# EAGLE design pcb_control_esp (EAGLE 7.4.0)
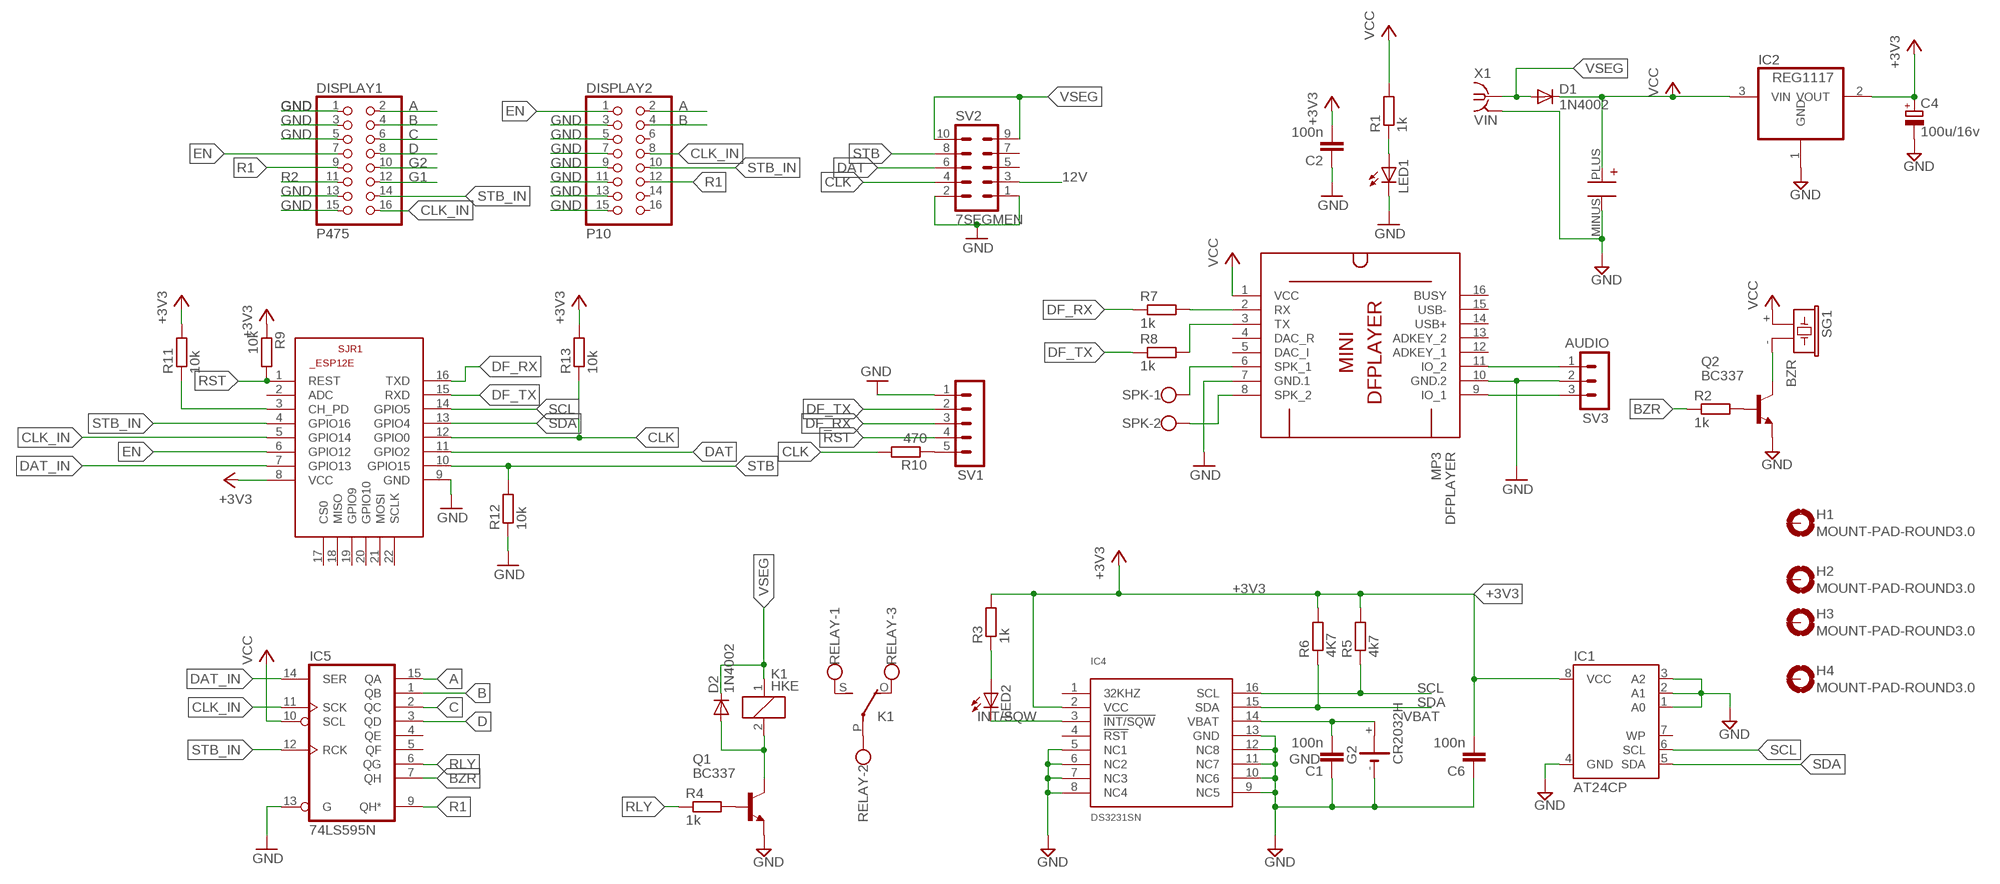
[diagram p0: schematic, sheet 1]

## Parts
C1  100n  C-EU025-024X044  [C025-024X044]
C2  100n  C-EU025-024X044  [C025-024X044]
C4  100u/16v  CPOL-EUE2.5-5  [E2,5-5]
C6  100n  C-EU025-024X044  [C025-024X044]
C24  1000U  EEU-FR1C471B  [EEU-FR1C471B]
D1  1N4002  1N4148DO35-10  [DO35-10]
D2  1N4002  1N4148DO35-10  [DO35-10]
DFPLAYER  MP3  DFPLAYER-MINI-MODULE  [DFPLAYER-MINI-MODULE]
DISPLAY1  P475  PINHD-2X8  [2X08]
DISPLAY2  P10  PINHD-2X8  [2X08]
G2  CR2032H  [CR2032H]
H1  MOUNT-PAD-ROUND3.0  [3,0-PAD]
H2  MOUNT-PAD-ROUND3.0  [3,0-PAD]
H3  MOUNT-PAD-ROUND3.0  [3,0-PAD]
H4  MOUNT-PAD-ROUND3.0  [3,0-PAD]
IC1  AT24CP  [DIL08]
IC2  REG1117  [SOT223]
IC4  DS3231SN  [SO16W]
IC5  74LS595N  [DIL16]
K1  HKE  ZF112  [ZF112]
LED1  LED3MM  [LED3MM]
LED2  LED3MM  [LED3MM]
Q1  BC337  BC548  [TO92-EBC]
Q2  BC337  BC548  [TO92-EBC]
R1  1k  R-EU_0207/7  [0207/7]
R2  1k  R-EU_0207/7  [0207/7]
R3  1k  R-EU_0207/7  [0207/7]
R4  1k  R-EU_0207/7  [0207/7]
R5  4k7  R-EU_0207/7  [0207/7]
R6  4K7  R-EU_0207/7  [0207/7]
R7  1k  R-EU_0207/7  [0207/7]
R8  1k  R-EU_0207/7  [0207/7]
R9  10k  R-EU_0207/7  [0207/7]
R10  470  R-EU_0207/7  [0207/7]
R11  10k  R-EU_0207/7  [0207/7]
R12  10k  R-EU_0207/7  [0207/7]
R13  10k  R-EU_0207/7  [0207/7]
RELAY  W237-103  [W237-103]
SG1  BZR  F/CM12P  [F/CM12P]
SJR1  ESP8266-12EESP12E  [ESP8266-ESP12E]
SPK  W237-102  [W237-102]
SV1  MA05-1  [MA05-1]
SV2  7SEGMEN  MA05-2  [MA05-2]
SV3  AUDIO  MA03-1  [MA03-1]
X1  VIN  SMA-J502-ND  [J502-ND]

## Nets
12V: SV2.3
+3V3: C2.2 C4.+ C6.2 IC1.8(VCC) IC2.2(VOUT) IC4.2(VCC) R3.2 R5.2 R6.2 R9.1 R11.2 R13.2 SJR1.8(VCC)
A: DISPLAY1.2 DISPLAY2.2 IC5.15(QA)
B: DISPLAY1.4 DISPLAY2.4 IC5.1(QB)
BZR: IC5.7(QH) R2.1
C: DISPLAY1.6 IC5.2(QC)
CLK: R10.2 R13.1 SJR1.12(GPIO0) SV2.4
CLK_IN: DISPLAY1.16 DISPLAY2.8 IC5.11(SCK) SJR1.5(GPIO14)
D: DISPLAY1.8 IC5.3(QD)
DAT: SJR1.11(GPIO2) SV2.6
DAT_IN: IC5.14(SER) SJR1.7(GPIO13)
DF_RX: R7.1 SJR1.16(TXD) SV1.3
DF_TX: R8.1 SJR1.15(RXD) SV1.2
EN: DISPLAY1.7 DISPLAY2.1 SJR1.6(GPIO12)
G1: DISPLAY1.12
G2: DISPLAY1.10
GND: C1.1 C2.1 C4.- C6.1 C24.MINUS DFPLAYER.7(GND.1) DFPLAYER.10(GND.2) DISPLAY1.1 DISPLAY1.3 DISPLAY1.5 DISPLAY1.13 DISPLAY1.15 DISPLAY2.3 DISPLAY2.5 DISPLAY2.7 DISPLAY2.9 DISPLAY2.11 DISPLAY2.13 DISPLAY2.15 G2.- IC1.1(A0) IC1.2(A1) IC1.3(A2) IC1.4(GND) IC2.1(GND) IC4.5(NC1) IC4.6(NC2) IC4.7(NC3) IC4.8(NC4) IC4.9(NC5) IC4.10(NC6) IC4.11(NC7) IC4.12(NC8) IC4.13(GND) IC5.13(G) LED1.K(C) Q1.E Q2.E R12.1 SJR1.9(GND) SV1.1 SV2.1 SV2.2 SV3.2 X1.2 X1.5
INT/SQW: IC4.3(!INT/SQW) LED2.K(C)
N$1: Q2.B R2.2
N$2: Q2.C SG1.-
N$3: LED2.A R3.1
N$4: K1.O(2:O) RELAY.3
N$5: R11.1 SJR1.3(CH_PD)
N$6: Q1.B R4.2
N$7: LED1.A R1.1
N$8: DFPLAYER.2(RX) R7.2
N$9: DFPLAYER.3(TX) R8.2
N$10: D2.A K1.2 Q1.C
N$11: R10.1 SV1.5
N$12: K1.S(2:S) RELAY.1
N$13: K1.P(2:P) RELAY.2
N$21: DFPLAYER.6(SPK_1) SPK.1
N$22: DFPLAYER.8(SPK_2) SPK.2
N$23: DFPLAYER.9(IO_1) SV3.3
N$24: DFPLAYER.11(IO_2) SV3.1
R1: DISPLAY1.9 DISPLAY2.12 IC5.9(QH*)
R2: DISPLAY1.11
RLY: IC5.6(QG) R4.1
RST: R9.2 SJR1.1(REST) SV1.4
SCL: IC1.6(SCL) IC4.16(SCL) R5.1 SJR1.14(GPIO5)
SDA: IC1.5(SDA) IC4.15(SDA) R6.1 SJR1.13(GPIO4)
STB: R12.2 SJR1.10(GPIO15) SV2.8
STB_IN: DISPLAY1.14 DISPLAY2.10 IC5.12(RCK) SJR1.4(GPIO16)
VBAT: C1.2 G2.+ IC4.14(VBAT)
VCC: C24.PLUS D1.C DFPLAYER.1(VCC) IC2.3(VIN) IC5.10(SCL) R1.2 SG1.+
VSEG: D1.A D2.C K1.1 SV2.9 SV2.10 X1.3 X1.4
Unconnected: DFPLAYER.4(DAC_R) DFPLAYER.5(DAC_I) DFPLAYER.12(ADKEY_1) DFPLAYER.13(ADKEY_2) DFPLAYER.14(USB+) DFPLAYER.15(USB-) DFPLAYER.16(BUSY) DISPLAY2.6 DISPLAY2.14 DISPLAY2.16 H1.B3,0(MOUNT) H2.B3,0(MOUNT) H3.B3,0(MOUNT) H4.B3,0(MOUNT) IC1.7(WP) IC4.1(32KHZ) IC4.4(!RST) IC5.4(QE) IC5.5(QF) SJR1.2(ADC) SJR1.17(CS0) SJR1.18(MISO) SJR1.19(GPIO9) SJR1.20(GPIO10) SJR1.21(MOSI) SJR1.22(SCLK) SV2.5 SV2.7

## Power pins joined to a net without a drawn wire
GND: IC5.8(GND)
VCC: IC5.16(VCC)

## Library data of the parts
C1 C2 C6 = rcl:C-EU: CAPACITOR, European symbol
C4 = rcl:CPOL-EU: POLARIZED CAPACITOR, European symbol
C24 = my:EEU-FR1C471B
D1 D2 = diode:1N4148: DIODE high speed (Philips)
DFPLAYER = diy-modules:DFPLAYER-MINI-MODULE: DFPlayer Mini - MP3 player module based on YX5200 chip More details available here: https://www.dfrobot.com/wiki/index.php/DFPlayer_Mini_SKU:DFR0299 Click here to find device on ebay.com <http://www.ebay.com/sch/dfplayer+mini>
DISPLAY1 DISPLAY2 = pinhead:PINHD-2X8: PIN HEADER
G2 = battery_cr2032:CR2032H: LI BATTERY Varta
H1-H4 = holes:MOUNT-PAD-ROUND: MOUNTING PAD, round
IC1 = atmel:AT24C*: 2-wire serial EEPROM; MPN: AT24C1024BW-SH-B; OC_FARNELL: 1362646; OC_NEWARK: 03P2044
IC2 = burr-brown:REG1117: 800mA and 1A Low Dropout (LDO) Positive Regulator 1.8V, 2.5V, 2.85V, 3.3V, 5V, and Adj; MPN: REG1117; OC_FARNELL: 1097566; OC_NEWARK: 14P6981
IC4 = comfile:DS3231SN
IC5 = 74xx-eu:74*595: 8-bit SHIFT REGISTER, output latch
K1 = relay:ZF112: RELAY 1 x switch; OC_FARNELL: unknown; OC_NEWARK: unknown
LED1 LED2 = adafruit:LED: LED OSRAM: - CHIPLED LG R971, LG N971, LY N971, LG Q971, LY Q971, LO R971, LY R971 LH N974, LH R974 LS Q976, LO Q976, LY Q976 LO Q996 - Hyper CHIPLED LW Q18S LB Q993, LB Q99A, LB R99A - SideLED LS A670, LO A670, LY A670, LG A670, LP A670 LB A673, LV A673, LT A673, LW A673 LH A674 LY A675 LS A676, LA A676, LO A676, LY A676, LW A676 LS A679, LY A679, LG A679 - Hyper Micro SIDELED® LS Y876, LA Y876, LO Y876, LY Y876 LT Y87S - SmartLED LW L88C, LW L88S LB L89C, LB L89S, LG L890 LS L89K, LO L89K, LY L89K LS L896, LA L896, LO L896, LY L896 - TOPLED LS T670, LO T670, LY T670, LG T670, LP T670 LSG T670, LSP T670, LSY T670, LOP T670, LYG T670 LG T671, LOG T671, LSG T671 LB T673, LV T673, LT T673, LW T673 LH T674 LS T676, LA T676, LO T676, LY T676, LB T676, LH T676, LSB T676, LW T676 LB T67C, LV T67C, LT T67C, LS T67K, LO T67K, LY T67K, LW E67C LS E67B, LA E67B, LO E67B, LY E67B, LB E67C, LV E67C, LT E67C LW T67C LS T679, LY T679, LG T679 LS T770, LO T770, LY T770, LG T770, LP T770 LB T773, LV T773, LT T773, LW T773 LH T774 LS E675, LA E675, LY E675, LS T675 LS T776, LA T776, LO T776, LY T776, LB T776 LHGB T686 LT T68C, LB T68C - Hyper Mini TOPLED® LB M676 - Mini TOPLED Santana® LG M470 LS M47K, LO M47K, LY M47K Source: http://www.osram.convergy.de/
Q1 Q2 = transistor-npn:BC548*: NPN Transistor
R1-R13 = rcl:R-EU_: RESISTOR, European symbol
RELAY = con-wago-500:W237-103: WAGO SCREW CLAMP; MPN: 237-103; OC_FARNELL: unknown; OC_NEWARK: 18M7116
SG1 = buzzer:F/CM12P: BUZZER Source: Buerklin; OC_FARNELL: unknown; OC_NEWARK: unknown
SJR1 = esp12e:ESP8266-12E: ESP8266-12E Library for Eagle CAD The author not responsible for any damages or errors!. Created by Suhail jr.lt;/author>
SPK = con-wago-500:W237-102: WAGO SCREW CLAMP; MPN: 237-102; OC_FARNELL: unknown; OC_NEWARK: 70K9898
SV1 = con-lstb:MA05-1: PIN HEADER; OC_FARNELL: unknown; OC_NEWARK: unknown
SV2 = con-lstb:MA05-2: PIN HEADER; OC_FARNELL: unknown; OC_NEWARK: unknown
SV3 = con-lstb:MA03-1: PIN HEADER; OC_FARNELL: unknown; OC_NEWARK: unknown
X1 = con-coax:SMA-: SMA 50 Ohm End Launch Jack Receptacle - Round Contact Johnson Components Source: www.johnsoncomponents.com .. J502-ND.pdf; OC_FARNELL: unknown; OC_NEWARK: unknown

## Net classes
0 default: width 0.254 mm, drill 0.381 mm, clearance 0.254 mm
1 SUPPLY: width 0.762 mm, drill 0.762 mm, clearance 0.254 mm to class 0, clearance 0.254 mm
2 SUPPLYP: width 0.762 mm, drill 0.762 mm, clearance 0.254 mm to class 0, clearance 0.254 mm to class 1, clearance 0.254 mm
3 OSC: width 0.254 mm, drill 0.381 mm, clearance 0.381 mm to class 0, clearance 0.381 mm to class 1, clearance 0.381 mm to class 2, clearance 0.381 mm

## Board
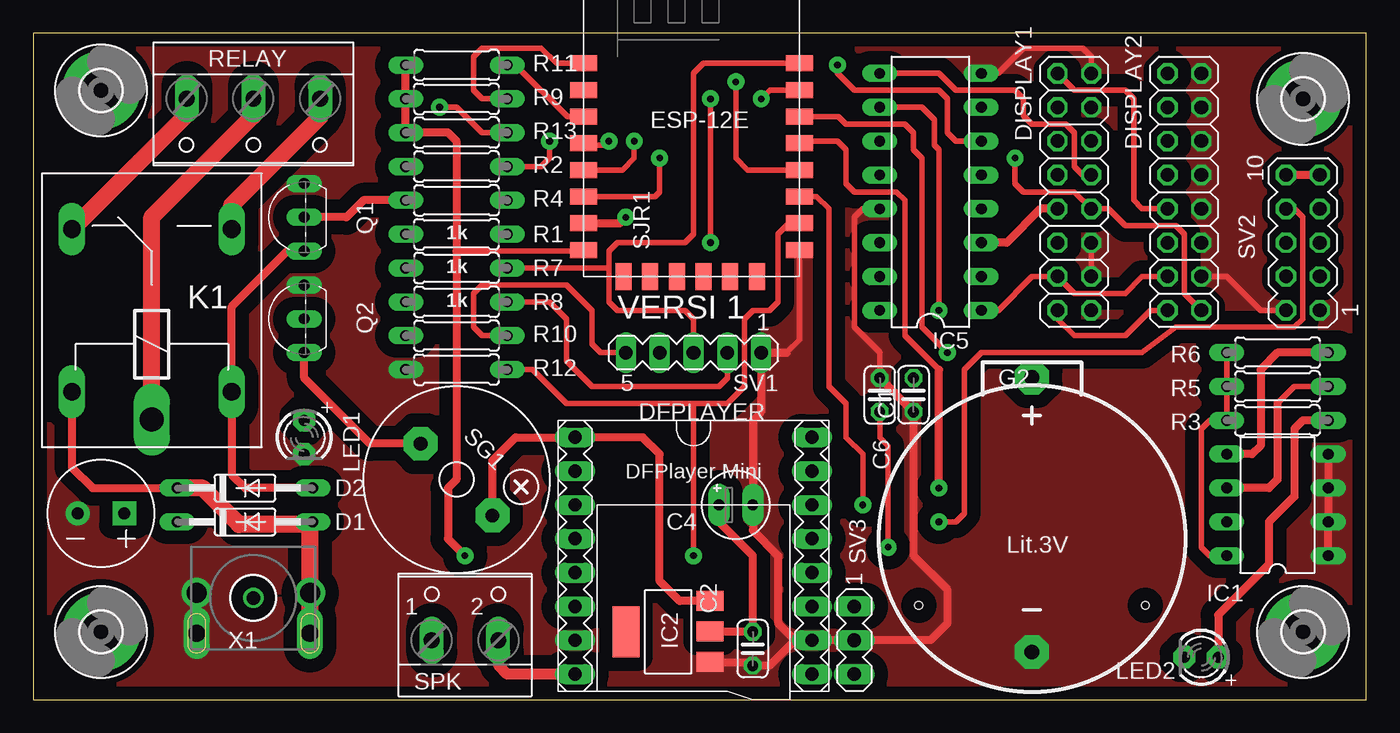
[diagram p1: board, top side]
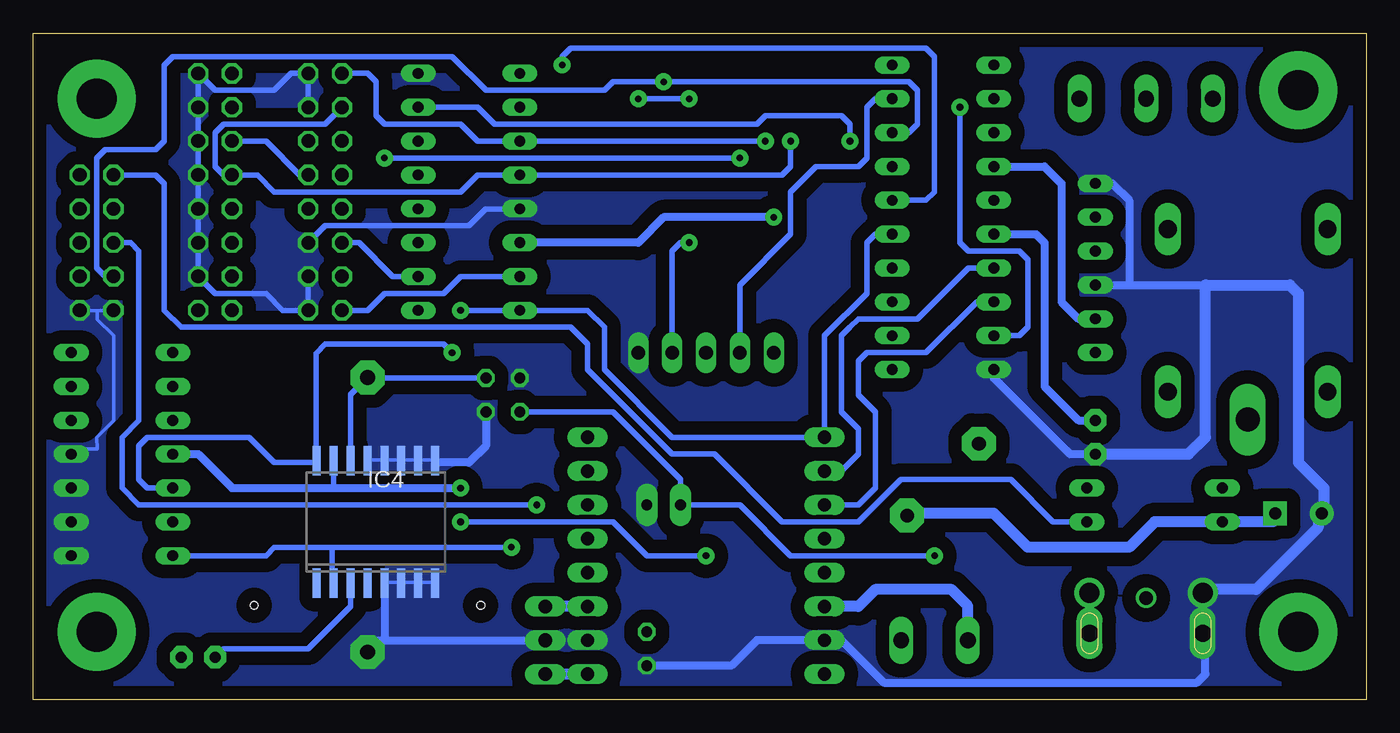
[diagram p2: board, bottom side, seen from below]

Size 100 x 50 mm. Coordinates in mm from the lower left corner, seen from the top.
Outline: 0,0 100,0 100,50 0,50 0,0
Copper layers (1*16): Top 0.035mm / dielectric 1.5mm / Bottom 0.035mm
Design rules "default": minimum track width 10mil, minimum drill 24mil, track to track 8mil, track to pad 8mil, pad to pad 8mil, via to via 8mil, smd to smd 8mil, copper to edge 40mil, drill to drill 8mil, minimum pad ring 10mil, minimum via ring 8mil, stop-mask expansion 4mil, vias tented up to drill 0mil, thermal gap 10mil

### Footprints (pad centres in the part's own frame; a part is rotated, then mirrored left to right if it is on the bottom)
C025-024X044 = drill 0.813 octagon: 1 -1.27,0; 2 1.27,0
E2,5-5 = drill 0.813 pad 1.6 long: + -1.27,0; - 1.27,0
EEU-FR1C471B = drill 0.9 pad 1.778: MINUS 1.75,0 | drill 0.9 pad 1.778 square: PLUS -1.75,0
DO35-10 = drill 0.813 long: A 5.08,0; C -5.08,0
DFPLAYER-MINI-MODULE = drill 1 long: 1 -8.89,-8.89; 2 -6.35,-8.89; 3 -3.81,-8.89; 4 -1.27,-8.89; 5 1.27,-8.89; 6 3.81,-8.89; 7 6.35,-8.89; 8 8.89,-8.89; 9 8.89,8.89; 10 6.35,8.89; 11 3.81,8.89; 12 1.27,8.89; 13 -1.27,8.89; 14 -3.81,8.89; 15 -6.35,8.89; 16 -8.89,8.89
2X08 = drill 1.016 octagon: 1 -8.89,-1.27; 2 -8.89,1.27; 3 -6.35,-1.27; 4 -6.35,1.27; 5 -3.81,-1.27; 6 -3.81,1.27; 7 -1.27,-1.27; 8 -1.27,1.27; 9 1.27,-1.27; 10 1.27,1.27; 11 3.81,-1.27; 12 3.81,1.27; 13 6.35,-1.27; 14 6.35,1.27; 15 8.89,-1.27; 16 8.89,1.27
CR2032H = drill 1.118 pad 2.54 octagon: + 0,12.1; - 0,-8.5 | hole 0.6: -8.5,-5; 8.5,-5
3,0-PAD = drill 3 pad 5.842: B3,0 0,0
DIL08 = drill 0.813 long: 1 -3.81,-3.81; 2 -1.27,-3.81; 3 1.27,-3.81; 4 3.81,-3.81; 5 3.81,3.81; 6 1.27,3.81; 7 -1.27,3.81; 8 -3.81,3.81
SOT223 = smd 1.499 x 2.007: 1 -2.261,-3.15; 2 0.025,-3.15; 3 2.311,-3.15 | smd 3.81 x 2.007: 4 0,3.15
SO16W = smd 0.6 x 2.2: 1 -4.445,-4.6; 2 -3.175,-4.6; 3 -1.905,-4.6; 4 -0.635,-4.6; 5 0.635,-4.6; 6 1.905,-4.6; 7 3.175,-4.6; 8 4.445,-4.6; 9 4.445,4.6; 10 3.175,4.6; 11 1.905,4.6; 12 0.635,4.6; 13 -0.635,4.6; 14 -1.905,4.6; 15 -3.175,4.6; 16 -4.445,4.6
DIL16 = drill 0.813 long: 1 -8.89,-3.81; 2 -6.35,-3.81; 3 -3.81,-3.81; 4 -1.27,-3.81; 5 1.27,-3.81; 6 3.81,-3.81; 7 6.35,-3.81; 8 8.89,-3.81; 9 8.89,3.81; 10 6.35,3.81; 11 3.81,3.81; 12 1.27,3.81; 13 -1.27,3.81; 14 -3.81,3.81; 15 -6.35,3.81; 16 -8.89,3.81
ZF112 = drill 1.321 long: 1 -6.096,5.994; 2 -6.096,-5.994; O 6.096,5.994; S 6.096,-5.994 | drill 1.803 long: P -8.204,0
LED3MM = drill 0.813 pad 1.676 octagon: A -1.27,0; K 1.27,0
TO92-EBC = drill 0.813 long: B 0,-1.27; C -2.54,-1.27; E 2.54,-1.27
0207/7 = drill 0.813 long: 1 -3.81,0; 2 3.81,0
W237-103 = drill 1.194 long: 1 -5,-1.29; 2 0,-1.29; 3 5,-1.29
F/CM12P = drill 1.016 pad 2.54 octagon: + 3.81,0; - -3.81,0
ESP8266-ESP12E = smd 2 x 1.2: 1 -7.62,5.84; 2 -7.62,3.84; 3 -7.62,1.84; 4 -7.62,-0.16; 5 -7.62,-2.16; 6 -7.62,-4.16; 7 -7.62,-6.16; 8 -7.62,-8.16; 9 8.58,-8.16; 10 8.58,-6.16; 11 8.58,-4.16; 12 8.58,-2.16; 13 8.58,-0.16; 14 8.58,1.84; 15 8.58,3.84; 16 8.58,5.84 | smd 1.2 x 2: 17 -4.62,-10.16; 18 -2.62,-10.16; 19 -0.62,-10.16; 20 1.38,-10.16; 21 3.38,-10.16; 22 5.38,-10.16
W237-102 = drill 1.194 long: 1 -2.5,-1.27; 2 2.5,-1.27
MA05-1 = drill 1.016 long: 1 -5.08,0; 2 -2.54,0; 3 0,0; 4 2.54,0; 5 5.08,0
MA05-2 = drill 1.016 octagon: 1 -5.08,-1.27; 2 -5.08,1.27; 3 -2.54,-1.27; 4 -2.54,1.27; 5 0,-1.27; 6 0,1.27; 7 2.54,-1.27; 8 2.54,1.27; 9 5.08,-1.27; 10 5.08,1.27
MA03-1 = drill 1.016 long: 1 -2.54,0; 2 0,0; 3 2.54,0
J502-ND = drill 1: 1 0,0 | drill 1.5: 2 -4.25,0.4; 3 4.25,0.4 | drill 1.3 long: 4 4.25,-2.65; 5 -4.25,-2.65

### Placement (x,y rotation side)
C1  66.04,22.86 90 top
C2  53.98,3.81 90 top
C4  52.7,14.61 0 top
C6  63.5,22.86 270 top
C24  5.08,13.97 180 top
D1  15.88,13.34 0 top
D2  15.88,15.88 0 top
DFPLAYER  49.53,10.79 270 top
DISPLAY1  78.11,38.1 90 top
DISPLAY2  86.36,38.1 90 top
G2  74.93,12.06 0 top
H1  95.25,5.08 0 top
H2  5.08,45.72 0 top
H3  95.25,45.09 0 top
H4  5.08,5.08 0 top
IC1  93.34,14.61 90 top
IC2  47.62,5.08 90 top
IC4  74.3,13.34 0 bottom
IC5  67.31,38.1 90 top
K1  8.89,29.21 90 top
LED1  20.32,19.68 270 top
LED2  87.63,3.17 180 top
Q1  19.05,36.2 90 top
Q2  19.05,28.57 90 top
R1  31.75,34.92 0 top
R2  31.75,40.01 180 top
R3  93.34,20.95 180 top
R4  31.75,37.47 180 top
R5  93.34,23.5 180 top
R6  93.34,26.04 180 top
R7  31.75,32.38 180 top
R8  31.75,29.84 180 top
R9  31.75,45.09 0 top
R10  31.75,27.3 180 top
R11  31.75,47.62 180 top
R12  31.75,24.77 0 top
R13  31.75,42.55 180 top
RELAY  16.51,43.81 180 top
SG1  31.75,16.51 315 top
SJR1  48.9,41.91 0 top
SPK  32.38,5.71 0 top
SV1  49.53,26.04 180 top
SV2  95.25,34.29 90 top
SV3  61.59,4.45 270 top
X1  16.51,7.62 0 top

### Tracks (layer width: path | path; a pad name or v marks a point on that pad's centre or on a via)
+3V3  (via drill 0.5 pad 1.27)
  Top 0.254: 28,42.4 R13.2
  Top 0.406: R6.2 R5.2 R3.2 88.27,20.95 87.63,20.32 87.63,11.43 88.27,10.79 IC1.8 | SJR1.8 41.27,33.66 32.07,33.66 | C6.2 63.5,19.68 64.14,19.05 v64.14,11.43
  Top 0.61: C4.+ 51.44,13.34 53.98,10.79 C2.2 53.95,5.11 IC2.2 | R11.2 R9.1 R13.2 31.11,42.55 31.75,41.91 31.75,33.66 | 31.75,33.66 31.75,16.51 31.11,15.88 31.11,12.06 v32.38,10.79 | 32.07,33.66 31.75,33.66
  Bottom 0.254: 77.6,8.8 IC4.2 | 51.6,14.8 C4.+ 51.2,14.4
  Bottom 0.406: C6.2 56.52,21.59 51.44,16.51 C4.+ 46.99,14.61 43.18,10.79 v32.38,10.79 | v64.14,11.43 77.47,11.43 | 77.47,11.43 81.92,11.43 82.55,10.79 IC1.8 | 77.6,8.8 77.6,11.3 77.47,11.43
A
  Top 0.406: DISPLAY2.2 83.82,29.21 81.92,27.3 78.11,27.3 76.83,28.57 DISPLAY1.2
  Bottom 0.406: IC5.15 67.94,31.75 69.22,30.48 73.66,30.48 74.93,29.21 DISPLAY1.2
B
  Top 0.406: IC5.1 72.39,29.21 74.93,31.75 DISPLAY1.4 78.11,30.48 81.92,30.48 83.19,31.75 DISPLAY2.4
BZR  (via drill 0.5 pad 1.27)
  Top 0.406: v38.73,41.91 38.73,40.64 38.1,40.01 R2.1
  Bottom 0.406: IC5.7 66.67,44.45 65.41,43.18 45.72,43.18 45.09,43.81 39.37,43.81 38.73,43.18 v38.73,41.91
C
  Bottom 0.406: IC5.2 73.03,31.75 75.56,34.29 DISPLAY1.6
CLK  (via drill 0.5 pad 1.27)
  Top 0.406: SJR1.12 53.59,39.75 52.7,40.64 v52.7,46.35 | v30.48,44.45 31.75,44.45 33.66,42.55 R13.1
  Bottom 0.406: R13.1 34.29,42.55 33.66,43.18 33.66,45.72 34.29,46.35 v52.7,46.35 56.52,46.35 57.15,45.72 66.04,45.72 68.58,48.26 89.53,48.26 90.17,47.62 90.17,41.91 90.81,41.27 94.61,41.27 95.25,40.64 95.25,32.38 94.61,31.75 SV2.4 | R10.2 26.04,27.3 25.4,27.94 25.4,33.02 26.04,33.66 29.84,33.66 30.48,34.29 v30.48,44.45
CLK_IN  (via drill 0.5 pad 1.27)
  Top 0.406: DISPLAY2.8 83.19,36.83 82.55,37.47 82.55,45.09 81.92,45.72 78.11,45.72 DISPLAY1.16 | v45.09,41.91 45.09,40.64 44.2,39.75 SJR1.5
  Bottom 0.406: DISPLAY1.16 74.93,46.99 74.3,46.35 74.3,43.81 73.66,43.18 67.94,43.18 66.67,41.91 IC5.11 v45.09,41.91
D
  Top 0.61: DISPLAY1.8 75.56,36.83 73.03,34.29 IC5.3
DAT  (via drill 0.5 pad 1.27)
  Top 0.406: SJR1.11 58.77,37.75 59.69,36.83 59.69,23.5 60.96,22.23 60.96,19.68 62.23,18.41 v62.23,14.61
  Bottom 0.406: SV2.6 92.71,34.29 92.08,33.66 92.08,20.95 93.34,19.68 93.34,15.88 92.08,14.61 v62.23,14.61
DAT_IN  (via drill 0.5 pad 1.27)
  Top 0.61: SJR1.7 44.01,35.75 v44.45,36.2
  Bottom 0.61: v44.45,36.2 52.7,36.2 54.61,34.29 IC5.14
DF_RX
  Top 0.406: SJR1.16 50.29,47.75 49.53,46.99 49.53,34.92 48.9,34.29 43.81,34.29 43.18,33.66 43.18,32.38 | 43.18,32.38 43.18,29.84 43.81,29.21 48.9,29.21 49.53,28.57 SV1.3 | R7.1 43.18,32.38
DF_TX  (via drill 0.5 pad 1.27)
  Top 0.406: R8.1 38.73,29.84 40.01,28.57 40.01,25.4 41.91,23.5 51.44,23.5 52.07,24.13 SV1.2 | SJR1.15 55.27,45.75 v54.61,45.09 | v50.8,45.09 v50.8,34.29
  Bottom 0.406: v54.61,45.09 v50.8,45.09 | v50.8,34.29 51.44,34.29 52.07,33.66 SV1.2
EN  (via drill 0.5 pad 1.27)
  Top 0.406: DISPLAY2.1 86.36,30.48 86.36,34.92 85.72,35.56 81.92,35.56 80.64,36.83 DISPLAY1.7 78.11,38.1 74.3,38.1 73.66,38.73 v73.66,40.64 | v46.99,40.64 46.99,38.1 46.64,37.75 SJR1.6
  Bottom 0.406: v73.66,40.64 v46.99,40.64
GND
  Top 0.254: 50.8,2.8 IC2.1
  Top 0.406: SJR1.9 57.48,27 56.52,26.04 | C6.1 63.5,26.04 61.59,27.94 61.59,36.2 62.23,36.83 IC5.13 | DISPLAY1.5 DISPLAY1.3 | IC5.8 72.39,46.99 74.3,48.9 78.74,48.9 79.38,48.26 DISPLAY1.15 | DISPLAY2.3 89.53,31.75 92.08,29.21 SV2.2
  Top 0.61: IC1.1 IC1.2 IC1.3 IC1.4 | C6.1 C1.1 66.04,10.79 68.58,8.26 68.58,5.71 67.31,4.45 SV3.2 DFPLAYER.10 57.15,4.45 | 57.15,4.45 55.24,2.54 C2.1 53.72,2.8 50.8,2.8 | 57.15,4.45 55.88,5.71 55.88,10.79 53.98,12.7 C4.- 53.98,20.95 54.61,21.59 SV1.1 56.52,26.04
  Bottom 0.254: 71.2,18 70,18 IC4.9 | 71.2,18 72.4,18 | 71.2,18 IC4.10 | 72.4,18 73.6,18 | 72.4,18 IC4.11 | 73.6,18 74.8,18 IC4.13 | 73.6,18 IC4.12 | 69.6,18 IC4.9 | 95.2,29.2 96.4,29.2 SV2.1 | 95.2,29.2 94,29.2 SV2.2 | 95.2,29.2 95.2,28.52 93.98,27.3 93.98,20.95 95.25,19.68 95.2,18.8 96.8,18.8 IC1.4 | 63.6,36.8 IC5.13 | 79.2,34.4 DISPLAY1.5 | 3.6,13.6 C24.MINUS | 71.2,8.8 70,8.8 IC4.8 | 71.2,8.8 72.4,8.8 | 71.2,8.8 IC4.7 | 72.4,8.8 73.6,8.8 IC4.5 | 72.4,8.8 IC4.6 | 69.6,17.6 IC4.9
  Bottom 0.406: DISPLAY1.3 DISPLAY1.1 81.28,29.21 82.55,30.48 86.36,30.48 DISPLAY2.3 DISPLAY2.5 DISPLAY2.7 DISPLAY2.9 DISPLAY2.11 DISPLAY2.13 DISPLAY2.15 86.36,45.72 81.92,45.72 80.64,46.99 DISPLAY1.15 DISPLAY1.13 | 63.6,36.8 66.07,36.8 67.31,35.56 78.11,35.56 DISPLAY1.5
  Bottom 0.61: Q1.E 19.05,38.73 17.78,37.47 17.78,31.11 | 17.78,31.11 12.06,31.11 | Q2.E 17.78,31.11 | R12.1 27.94,24.13 22.23,18.41 LED1.K | G2.- 74.54,3.56 74.3,3.81 74.93,4.45 73.66,4.45 | 73.66,4.45 SV3.2 | IC4.5 73.66,4.45 | X1.2 X1.5 12.06,4.78 12.06,1.91 12.7,1.27 36.2,1.27 39.37,4.45 DFPLAYER.7 45.72,4.45 47.62,2.54 C2.1 | C1.1 66.04,19.05 67.31,17.78 69.69,17.78 IC4.9
  Bottom 0.813: LED1.K 13.34,18.41 12.06,19.68 12.06,31.11 5.71,31.11 5.08,30.48 5.08,17.78 3.17,15.88 3.17,14.12 C24.MINUS | 3.6,13.6 3.6,12.91 8.26,8.26 11.43,8.26 12.06,7.62
  pour Bottom (isolate 1.016, no thermals): 100.33,0 100.33,50.16 0,50.16 0,0
  pour Top (isolate 1.016, no thermals): 0,50.16 100.33,50.16 100.33,0 0,0
INT/SQW
  Bottom 0.406: IC4.3 76.2,6.99 79.38,3.81 85.72,3.81 LED2.K
N$1
  Bottom 0.61: R2.2 24.13,40.01 22.86,38.73 22.86,29.84 21.59,28.57 Q2.B
N$2
  Top 0.61: SG1.- 25.25,19.2 20.32,24.13 Q2.C
N$3
  Top 0.61: R3.1 95.25,20.95 94.61,20.32 94.61,15.24 92.71,13.34 92.71,10.16 88.9,6.35 LED2.A
N$4
  Top 1.27: K1.O 2.92,35.31 11.43,43.81 11.43,45.02 RELAY.3
N$5
  Top 0.406: R11.1 36.2,47.62 40.07,43.75 SJR1.3
N$6
  Top 0.61: R4.2 24.77,37.47 23.5,36.2 Q1.B
N$7
  Bottom 0.61: R1.1 24.77,34.92 24.13,34.29 24.13,23.5 21.59,20.95 LED1.A
N$8
  Bottom 0.406: DFPLAYER.2 39.37,17.14 38.1,18.41 38.1,20.32 38.73,20.95 39.37,21.59 39.37,27.3 38.73,27.94 38.1,28.57 33.66,28.57 29.84,32.38 R7.2
N$9
  Bottom 0.406: R8.2 29.21,29.84 33.02,26.04 37.47,26.04 38.1,25.4 38.1,22.86 36.83,21.59 36.83,15.88 38.1,14.61 DFPLAYER.3
N$10
  Top 0.61: Q1.C 19.05,33.66 14.88,29.49 K1.2 14.88,16.87 15.88,15.88 D2.A
N$11
  Top 0.406: R10.1 33.66,27.3 33.02,27.94 33.02,30.48 33.66,31.11 40.01,31.11 41.91,29.21 41.91,26.67 42.55,26.04 SV1.5
N$12
  Top 1.27: RELAY.1 21.51,43.73 14.88,37.11 K1.S
N$13
  Top 1.27: K1.P 8.89,36.2 16.51,43.81 RELAY.2
N$21
  Bottom 0.813: SPK.1 29.89,7.03 31.11,8.26 36.83,8.26 38.1,6.99 DFPLAYER.6
N$22
  Top 0.813: DFPLAYER.8 35.56,1.91 34.92,2.54 34.92,4.41 SPK.2
N$23
  Bottom 0.813: DFPLAYER.9 SV3.3
N$24
  Bottom 0.813: DFPLAYER.11 SV3.1
R1
  Top 0.406: IC5.9 67.94,46.99 69.22,45.72 73.66,45.72 74.3,45.09 74.3,43.81 74.93,43.18 77.47,43.18 78.11,42.55 78.11,40.01 78.74,39.37 DISPLAY1.9
  Bottom 0.406: DISPLAY1.9 80.01,39.37 82.55,41.91 DISPLAY2.12
RLY  (via drill 0.5 pad 1.27)
  Top 0.406: IC5.6 69.22,41.91 68.58,42.55 68.58,45.09 67.94,45.72 61.59,45.72 60.33,46.99 v60.33,47.62
  Bottom 0.406: R4.1 33.02,37.47 32.38,38.1 32.38,48.26 33.02,48.9 59.69,48.9 60.33,48.26 v60.33,47.62
RST
  Top 0.406: SJR1.1 39.24,47.75 38.1,48.9 33.66,48.9 33.02,48.26 33.02,45.72 33.66,45.09 R9.2
  Bottom 0.406: R9.2 36.83,45.09 37.47,44.45 37.47,40.64 38.1,40.01 41.27,40.01 43.18,38.1 43.18,34.92 46.99,31.11 SV1.4
SCL  (via drill 0.5 pad 1.27)
  Top 0.406: R5.1 94.61,23.5 93.34,22.23 | SJR1.14 60.39,43.75 60.96,43.18 65.41,43.18 66.04,42.55 66.04,41.27 66.67,40.64 66.67,27.94 v68.58,26.04
  Top 0.61: 93.34,22.23 93.34,16.51 92.71,15.88 IC1.6
  Bottom 0.254: 78.8,18 IC4.16
  Bottom 0.406: 78.8,18 78.8,25.98 78.11,26.67 69.22,26.67 v68.58,26.04 | IC1.6 91.44,15.88 92.08,16.51 92.08,19.05 91.44,19.68 83.82,19.68 81.92,17.78 78.89,17.78 IC4.16
SDA  (via drill 0.5 pad 1.27)
  Top 0.406: SJR1.13 57.63,41.91 60.33,41.91 60.96,41.27 60.96,38.73 61.59,38.1 64.77,38.1 65.41,37.47 65.41,27.3 67.94,24.77
  Top 0.61: R6.1 93.34,26.04 92.08,24.77 92.08,19.05 91.44,18.41 IC1.5 | v67.94,15.88 67.94,24.77
  Bottom 0.406: IC4.15 77.47,15.88
  Bottom 0.61: IC1.5 87.63,18.41 85.09,15.88 77.47,15.88 v67.94,15.88
STB  (via drill 0.5 pad 1.27)
  Top 0.406: SV2.8 94.61,36.83 95.25,36.2 95.25,28.57 94.61,27.94 85.72,27.94 83.19,26.04 71.12,26.04 69.85,24.77 69.85,13.97 69.22,13.34 v67.94,13.34 | SJR1.10 56.7,35.75 55.88,34.92 55.88,29.84 55.24,29.21 53.98,29.21 53.34,28.57 53.34,23.5 52.07,22.23 49.53,22.23 | R12.2 37.47,24.77 40.01,22.23 49.53,22.23 | v49.53,10.79 49.53,22.23
  Bottom 0.406: v67.94,13.34 56.52,13.34 53.98,10.79 v49.53,10.79
STB_IN  (via drill 0.5 pad 1.27)
  Top 0.254: 41.6,41.6 SJR1.4
  Top 0.406: 41.6,41.6 42.87,41.6 v43.18,41.91
  Bottom 0.406: DISPLAY1.14 78.11,43.18 85.72,43.18 86.36,42.55 86.36,40.01 85.72,39.37 DISPLAY2.10 83.19,39.37 81.92,38.1 67.94,38.1 66.67,39.37 IC5.12 43.81,39.37 43.18,40.01 v43.18,41.91
VBAT
  Bottom 0.406: C1.2 74.89,24.13 G2.+ 76.2,22.89 IC4.14
VCC  (via drill 0.5 pad 1.27)
  Top 0.406: IC5.10 66.67,44.45 67.6,43.52 67.6,41.62 67.94,41.27 v67.94,29.21
  Top 0.61: SG1.+ 34.44,17.93 36.2,19.68 DFPLAYER.1 45.72,19.68 46.99,18.41 46.99,8.89 48.49,7.39 IC2.3
  Bottom 0.406: R1.2 36.83,34.92 37.47,34.29 37.47,30.48 40.64,27.3 DFPLAYER.1 52.07,19.68 57.15,24.77 57.15,27.94 58.42,29.21 IC5.16 v67.94,29.21
  Bottom 0.813: C24.PLUS 6.83,13.49 6.99,13.34 D1.C 15.88,13.34 17.78,11.43 25.4,11.43 27.94,13.97 34.29,13.97 SG1.+
VSEG
  Top 0.61: K1.1 2.9,17.42 4.45,15.88 10.16,15.88 D2.C | SV2.9 SV2.10
  Top 1.27: X1.4 X1.3 20.76,13.14 | 20.76,13.14 D1.A | 20.76,13.14 15.44,13.14 12.7,15.88 10.16,15.88
  Bottom 0.406: SV2.10 90.81,39.37 90.17,38.73 90.17,29.21 88.9,27.94 59.69,27.94 58.42,26.67 58.42,24.77 52.07,18.41 48.9,18.41 43.81,13.34 38.1,13.34 34.92,16.51 26.67,16.51 23.5,13.34 D1.A

### Text on the board
tPlace: VERSI 1